# Altium project Navigation and Locomotion Shield.PrjPcb
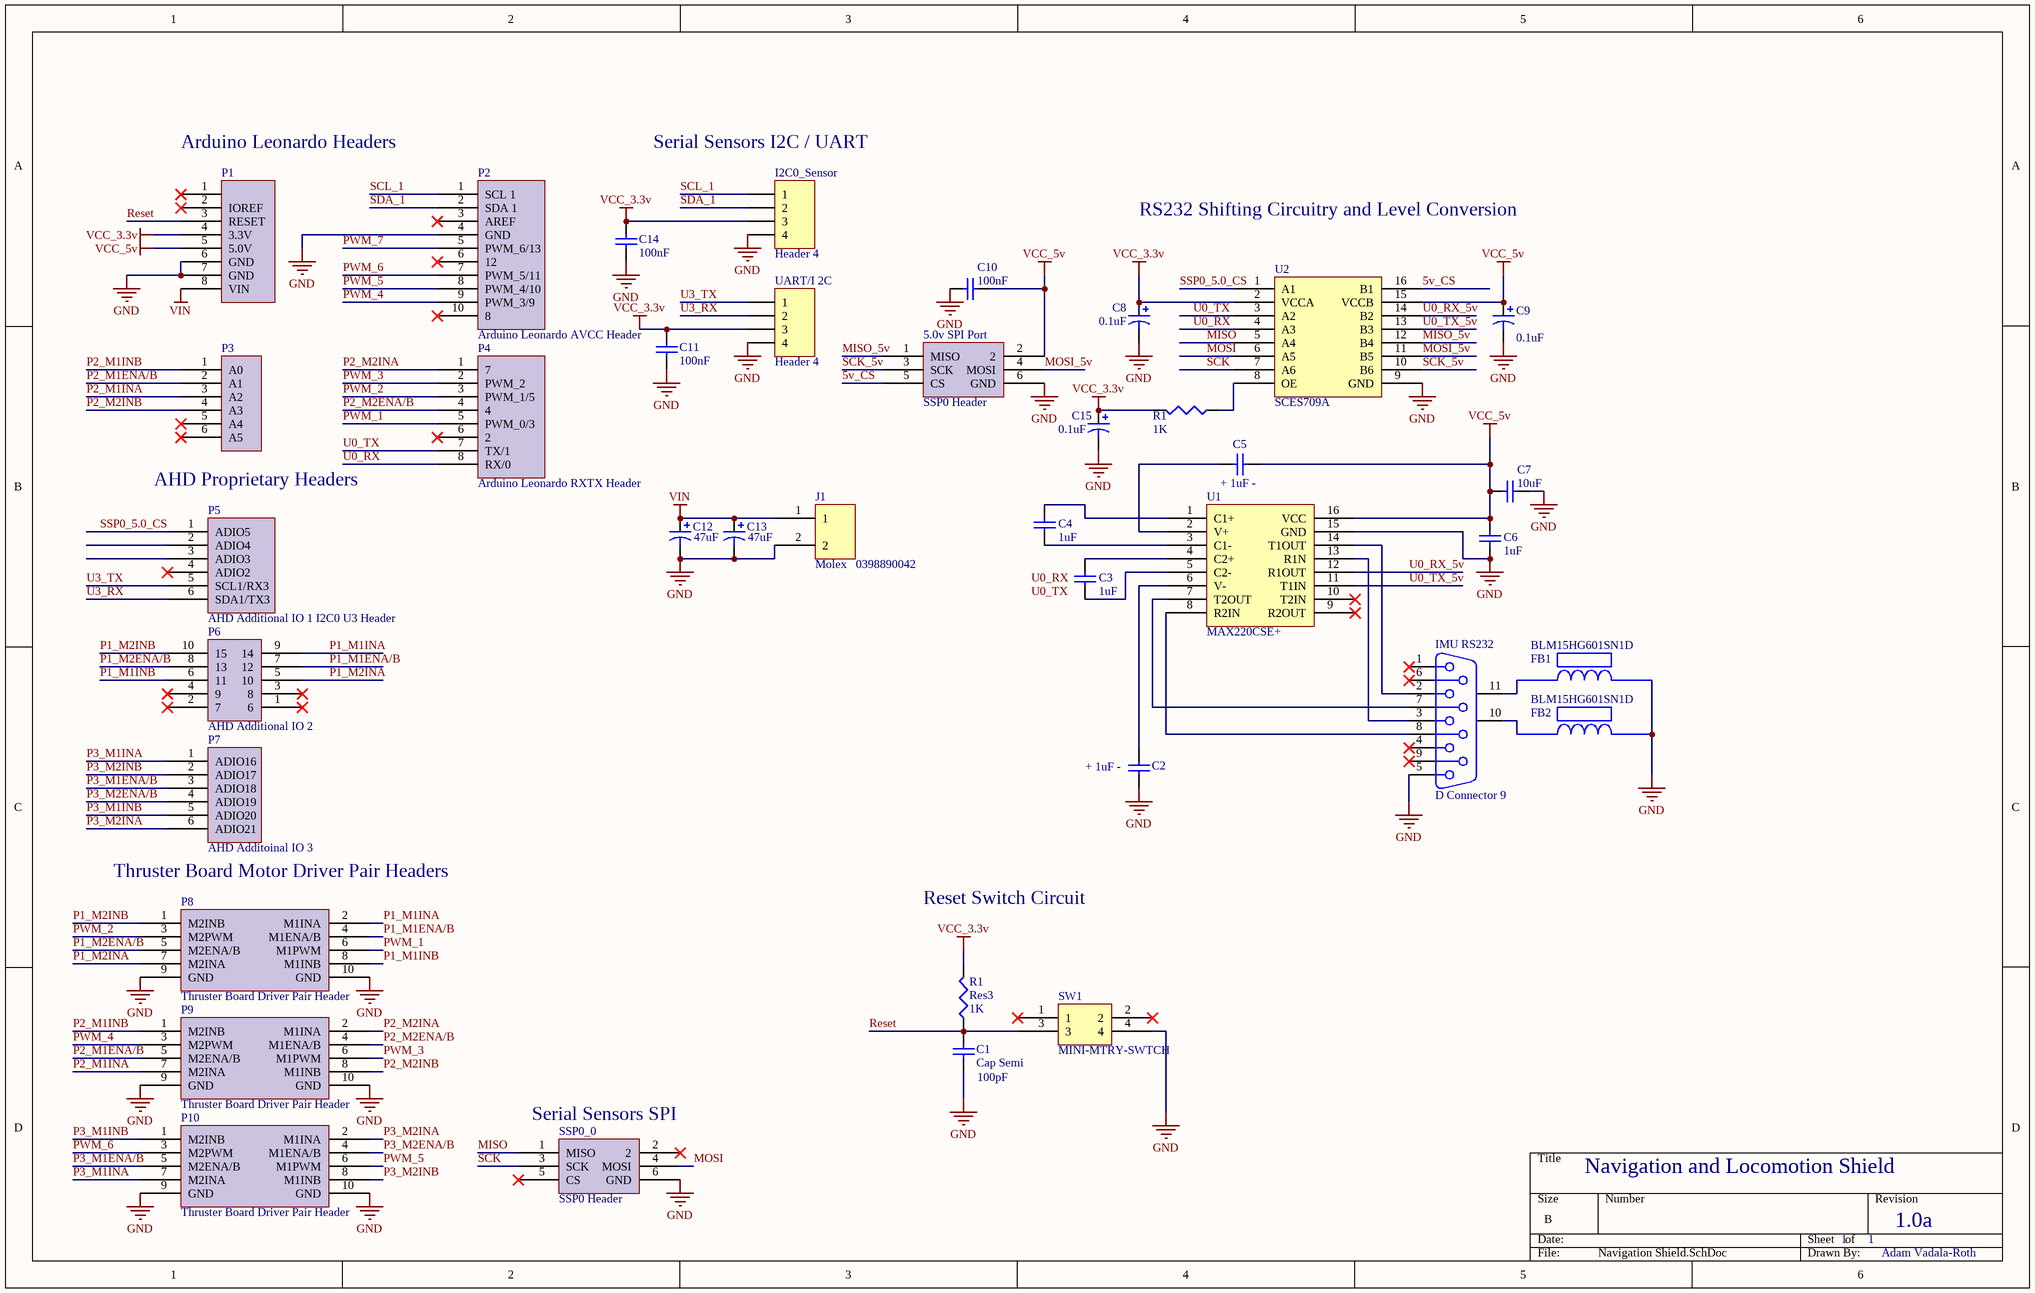
[diagram p0: Navigation Shield.SchDoc]
1 sheet, 38 parts. Net scope: global (net labels, ports and power ports of the same name join across sheets).
Board file: Navigation and Locomotion Shield.PcbDoc

## Sheet Navigation Shield.SchDoc: Navigation and Locomotion Shield
size B; DrawnBy: Adam Vadala-Roth; Revision: 1.0a; SheetNumber: 1; SheetTotal: 1

### Parts
(Parts that share a designator on the sheet are numbered #1, #2 ... from top to bottom, then left to right.)
5.0v_SPI_Port  SSP0 Header  [SSP0 Header]
C1  Cap Semi  value 100pF  [C1206]
C2  value + 1uF -  [C2512]  (hidden comment: Cap Semi)
C3  value 1uF  [C1206]  (hidden comment: Cap Semi)
C4  value 1uF  [C1206]  (hidden comment: Cap Semi)
C5  value + 1uF -  [C2512]  (hidden comment: Cap Semi)
C6  value 1uF  [C1206]  (hidden comment: Cap Semi)
C7  value 10uF  [C1206]  (hidden comment: Cap Semi)
C8  value 0.1uF  [C0805]  (hidden comment: Cap Pol3)
C9  value 0.1uF  [C0805]  (hidden comment: Cap Pol3)
C10  value 100nF  [C1206]  (hidden comment: Cap Semi)
C11  value 100nF  [C1206]  (hidden comment: Cap Semi)
C12  value 47uF  [CAPPR2.5-6.3x5/H.9]  (hidden comment: Cap Pol1)
C13  value 47uF  [CAPPR2.5-6.3x5/H.9]  (hidden comment: Cap Pol1)
C14  value 100nF  [C1206]  (hidden comment: Cap Semi)
C15  value 0.1uF  [C0805]  (hidden comment: Cap Pol3)
FB1  BLM15HG601SN1D  [BLM18PG121SN1D]
FB2  BLM15HG601SN1D  [BLM18PG121SN1D]
I2C0_Sensor  Header 4  [HDR1X4]
IMU_RS232  D Connector 9  [DSUB1.385-2H9]
J1  Molex   0398890042  [PCBComponent_1]
P1  Arduino Leonardo Power Header  [Arduino Leonardo Power Header]  (value not drawn)
P2  Arduino Leonardo AVCC Header  [Arduino Leonardo AVCC Header]
P3  Arduino Leonardo Analog Header  [Arduino Leonardo Analog Header]  (value not drawn)
P4  Arduino Leonardo RXTX Header  [Arduino Leonardo RXTX PWM Header]
P5  AHD Additional IO 1 I2C0 U3 Header  [AHD Additional IO 1 I2C1 U3]
P6  AHD Additional IO 2  [AHD Additional IO 2 front Digital Header]
P7  AHD Additoinal IO 3  [AHD Additional IO 3 Header]
P8  Thruster Board Driver Pair Header  [Thruster Board Drvier Pair Header]
P9  Thruster Board Driver Pair Header  [Thruster Board Drvier Pair Header]
P10  Thruster Board Driver Pair Header  [Thruster Board Drvier Pair Header]
R1#1  value 1K  [J1-0603]  (hidden comment: Res3)
R1#2  Res3  value 1K  [J1-0603]
SSP0_0  SSP0 Header  [SSP0 Header]
SW1  MINI-MTRY-SWTCH  [Momentary Switch]
U1  MAX220CSE+  [MAX220CES+]
U2  SCES709A  [SCES709a]
UART/I_2C  Header 4  [HDR1X4]

### Nets
GND: 5.0v_SPI_Port.6(GND) C1.1 C2.2 C6.1 C7.1 C8.2 C9.2 C10.2 C11.2 C12.2 C13.2 C14.2 C15.2 FB1.2 FB2.2 I2C0_Sensor.4 IMU_RS232.5 J1.2 P1.6(GND) P1.7(GND) P2.4(GND) P8.9(GND) P8.10(GND) P9.9(GND) P9.10(GND) P10.9(GND) P10.10(GND) SSP0_0.6(GND) SW1.4 U1.15(GND) U2.9(GND) UART/I_2C.4
VCC_3.3v: C8.1 C11.1 C14.1 C15.1 I2C0_Sensor.3 P1.4(3.3V) R1#1.2 R1#2.2 U2.2(VCCA) UART/I_2C.3
VCC_5v: 5.0v_SPI_Port.2 C5.2 C6.2 C7.2 C9.1 C10.1 P1.5(5.0V) U1.16(VCC) U2.15(VCCB)
VIN: C12.1 C13.1 J1.1 P1.8(VIN)
5v_CS: 5.0v_SPI_Port.5(CS) U2.16(B1)
MISO: SSP0_0.1(MISO) U2.5(A4)
MISO_5v: 5.0v_SPI_Port.1(MISO) U2.12(B4)
MOSI: SSP0_0.4(MOSI) U2.6(A5)
MOSI_5v: 5.0v_SPI_Port.4(MOSI) U2.11(B5)
P1_M1ENA/B: P6.7(12) P8.4(M1ENA/B)
P1_M1INA: P6.9(14) P8.2(M1INA)
P1_M1INB: P6.6(11) P8.8(M1INB)
P1_M2ENA/B: P6.8(13) P8.5(M2ENA/B)
P1_M2INA: P6.5(10) P8.7(M2INA)
P1_M2INB: P6.10(15) P8.1(M2INB)
P2_M1ENA/B: P3.2(A1) P9.5(M2ENA/B)
P2_M1INA: P3.3(A2) P9.7(M2INA)
P2_M1INB: P3.1(A0) P9.1(M2INB)
P2_M2ENA/B: P4.4 P9.4(M1ENA/B)
P2_M2INA: P4.1(7) P9.2(M1INA)
P2_M2INB: P3.4(A3) P9.8(M1INB)
P3_M1ENA/B: P7.3(ADIO18) P10.5(M2ENA/B)
P3_M1INA: P7.1(ADIO16) P10.7(M2INA)
P3_M1INB: P7.5(ADIO20) P10.1(M2INB)
P3_M2ENA/B: P7.4(ADIO19) P10.4(M1ENA/B)
P3_M2INA: P7.6(ADIO21) P10.2(M1INA)
P3_M2INB: P7.2(ADIO17) P10.8(M1INB)
PWM_1: P4.5(PWM_0/3) P8.6(M1PWM)
PWM_2: P4.3(PWM_1/5) P8.3(M2PWM)
PWM_3: P4.2(PWM_2) P9.6(M1PWM)
PWM_4: P2.9(PWM_3/9) P9.3(M2PWM)
PWM_5: P2.8(PWM_4/10) P10.6(M1PWM)
PWM_6: P2.7(PWM_5/11) P10.3(M2PWM)
PWM_7: P2.5(PWM_6/13)
Reset: C1.2 P1.3(RESET) R1#2.1 SW1.3
SCK: SSP0_0.3(SCK) U2.7(A6)
SCK_5v: 5.0v_SPI_Port.3(SCK) U2.10(B6)
SCL_1: I2C0_Sensor.1 P2.1(SCL_1)
SDA_1: I2C0_Sensor.2 P2.2(SDA_1)
SSP0_5.0_CS: P5.1(ADIO5) U2.1(A1)
U0_RX: P4.8(RX/0) U2.4(A3)
U0_RX_5v: U1.12(R1OUT) U2.14(B2)
U0_TX: P4.7(TX/1) U2.3(A2)
U0_TX_5v: U1.11(T1IN) U2.13(B3)
U3_RX: P5.6(SDA1/TX3) UART/I_2C.2
U3_TX: P5.5(SCL1/RX3) UART/I_2C.1
NetC2_1: C2.1 U1.6(V-)
NetC3_1: C3.1 U1.5(C2-)
NetC3_2: C3.2 U1.4(C2+)
NetC4_1: C4.1 U1.3(C1-)
NetC4_2: C4.2 U1.1(C1+)
NetC5_1: C5.1 U1.2(V+)
NetFB1_1: FB1.1 IMU_RS232.11(MH2)
NetFB2_1: FB2.1 IMU_RS232.10(MH1)
NetIMU_RS232_2: IMU_RS232.2 U1.14(T1OUT)
NetIMU_RS232_3: IMU_RS232.3 U1.13(R1N)
NetIMU_RS232_7: IMU_RS232.7 U1.7(T2OUT)
NetIMU_RS232_8: IMU_RS232.8 U1.8(R2IN)
NetR1#1_1: R1#1.1 U2.8(OE)

Not connected (* = marked no-connect by the designer): IMU_RS232 1* 4* 6* 9*; P1 1* 2(IOREF)*; P2 3(AREF)* 6(12)* 10(8)*; P3 5(A4)* 6(A5)*; P4 6(2)*; P5 2(ADIO4) 3(ADIO3) 4(ADIO2)*; P6 1(6)* 2(7)* 3(8)* 4(9)*; SSP0_0 2* 5(CS)*; SW1 1* 2*; U1 9(R2OUT)* 10(T2IN)*

### Notes on the sheet
- (near P1) Arduino Leonardo Headers
- (near I2C0_Sensor) Serial Sensors I2C / UART
- RS232 Shifting Circuitry and Level Conversion
- AHD Proprietary Headers
- Thruster Board Motor Driver Pair Headers
- Reset Switch Circuit
- (near SSP0_0) Serial Sensors SPI
- Labels drawn without touching a wire or pin: U0_RX, U0_TX

### Library data of the parts
C1-C7 C10 C11 C14 = Cap Semi: Capacitor (Semiconductor SIM Model); Published: 8-Jun-2000; LatestRevisionDate: 29-May-2009; LatestRevisionNote: IPC-7351 Footprint Added.; PackageReference: C1206; Publisher: Altium Limited; PackageDescription: Chip Capacitor
C8 C9 C15 = Cap Pol3: Polarized Capacitor (Surface Mount); Published: 8-Jun-2000; LatestRevisionDate: 29-May-2009; LatestRevisionNote: IPC-7351 Footprint Added.; PackageReference: C0805; Publisher: Altium Limited; PackageDescription: Chip Capacitor
C12 C13 = Cap Pol1: Polarized Capacitor (Radial); Published: 8-Jun-2000; LatestRevisionDate: 17-Jul-2002; LatestRevisionNote: Re-released for DXP Platform.; PackageReference: RB7.6-15; Publisher: Altium Limited; PackageDescription: Polarized Capacitor (Radial); 2 Leads
I2C0_Sensor UART/I_2C = Header 4: Header, 4-Pin; LatestRevisionDate: 17-Jul-2002; LatestRevisionNote: Re-released for DXP Platform.; Publisher: Altium Limited
IMU_RS232 = D Connector 9: Receptacle Assembly, 9 Position, Right Angle; PackageDocument: O; Positions: 9; Published: 15-Jun-2001; LatestRevisionDate: 17-Jul-2002; LatestRevisionNote: Re-released for DXP Platform.; DatasheetDocument: 1-Sep-1999; PackageReference: 788750; Publisher: Altium Limited; Orientation: Right Angle; Gender: Receptacle
J1 = Molex   0398890042 Screw Terminal: Screw Terminal
P2 = Arduino Leonardo AVCC Header: Arduino Leonardo AREF Header
R1#1 R1#2 = Res3: Resistor; Published: 8-Jun-2000; LatestRevisionDate: 29-May-2009; LatestRevisionNote: IPC-7351 Footprint Added.; PackageReference: J1-0603; Publisher: Altium Limited; PackageDescription: Chip Resistor
SW1 = Mini Momemtary Switch
U1 = MAX220CSE+: Maxim Integrated RS232 shifter IC